# EAGLE design PIC18_breakout (EAGLE 7.7.0)
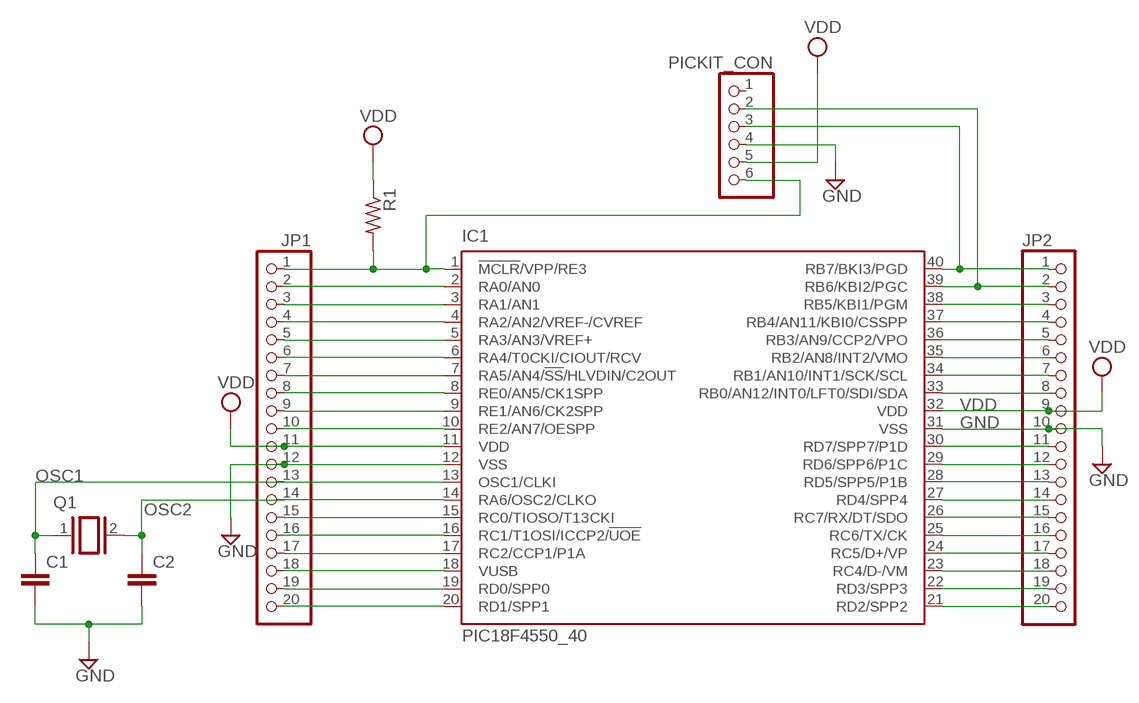
[diagram p0: schematic, sheet 1]

## Parts
C1  C-EU075-032X103  [C075-032X103]
C2  C-EU075-032X103  [C075-032X103]
IC1  PIC18F4550_40  [DIL40]
JP1  PINHD-1X20  [1X20]
JP2  PINHD-1X20  [1X20]
PICKIT_CON  PINHD-1X6/90  [1X06/90]
Q1  XTAL/S  [QS]
R1  R-US_0207/10  [0207/10]

## Nets
^MCLR/VPP: IC1.1(!MCLR!/VPP/RE3) JP1.1 PICKIT_CON.6 R1.2
GND: C1.2 C2.2 IC1.12(VSS) IC1.31(VSS) JP1.12 JP2.10 PICKIT_CON.4
N$1: IC1.2(RA0/AN0) JP1.2
N$2: IC1.3(RA1/AN1) JP1.3
N$3: IC1.4(RA2/AN2/VREF-/CVREF) JP1.4
N$4: IC1.5(RA3/AN3/VREF+) JP1.5
N$5: IC1.6(RA4/T0CKI/CIOUT/RCV) JP1.6
N$6: IC1.7(RA5/AN4/!SS!/HLVDIN/C2OUT) JP1.7
N$7: IC1.8(RE0/AN5/CK1SPP) JP1.8
N$8: IC1.9(RE1/AN6/CK2SPP) JP1.9
N$9: IC1.10(RE2/AN7/OESPP) JP1.10
N$10: IC1.37(RB4/AN11/KBI0/CSSPP) JP2.4
N$11: IC1.36(RB3/AN9/CCP2/VPO) JP2.5
N$12: IC1.15(RC0/TIOSO/T13CKI) JP1.15
N$13: IC1.16(RC1/T1OSI/ICCP2/!UOE) JP1.16
N$14: IC1.17(RC2/CCP1/P1A) JP1.17
N$15: IC1.18(VUSB) JP1.18
N$16: IC1.19(RD0/SPP0) JP1.19
N$17: IC1.20(RD1/SPP1) JP1.20
N$18: IC1.35(RB2/AN8/INT2/VMO) JP2.6
N$19: IC1.34(RB1/AN10/INT1/SCK/SCL) JP2.7
N$20: IC1.33(RB0/AN12/INT0/LFT0/SDI/SDA) JP2.8
N$21: IC1.30(RD7/SPP7/P1D) JP2.11
N$22: IC1.29(RD6/SPP6/P1C) JP2.12
N$23: IC1.28(RD5/SPP5/P1B) JP2.13
N$24: IC1.27(RD4/SPP4) JP2.14
N$25: IC1.26(RC7/RX/DT/SDO) JP2.15
N$26: IC1.25(RC6/TX/CK) JP2.16
N$27: IC1.24(RC5/D+/VP) JP2.17
N$28: IC1.23(RC4/D-/VM) JP2.18
N$29: IC1.22(RD3/SPP3) JP2.19
N$30: IC1.21(RD2/SPP2) JP2.20
OSC1: C1.1 IC1.13(OSC1/CLKI) JP1.13 Q1.1
OSC2: C2.1 IC1.14(RA6/OSC2/CLKO) JP1.14 Q1.2
PGC: IC1.39(RB6/KBI2/PGC) JP2.2 PICKIT_CON.2
PGD: IC1.40(RB7/BKI3/PGD) JP2.1 PICKIT_CON.3
PGM: IC1.38(RB5/KBI1/PGM) JP2.3
VDD: IC1.11(VDD) IC1.32(VDD) JP1.11 JP2.9 PICKIT_CON.5 R1.1
Unconnected: PICKIT_CON.1

## Library data of the parts
C1 C2 = rcl:C-EU: CAPACITOR, European symbol
IC1 = microchip:PIC18F4*_40: USB Microcontrollers with nanoWatt Technology High-Performance, Enhanced Flash, 28/40/44-Pin, Source: http://ww1.microchip.com/downloads/en/devicedoc/39632c.pdf; MF: MICROCHIP; MPN: PIC18F4550-I/P; OC_FARNELL: 9321357; OC_NEWARK: 74K8623
JP1 JP2 = pinhead:PINHD-1X20: PIN HEADER
PICKIT_CON = pinhead:PINHD-1X6: PIN HEADER
Q1 = special:XTAL/S: CRYSTAL
R1 = rcl:R-US_: RESISTOR, American symbol

## Board
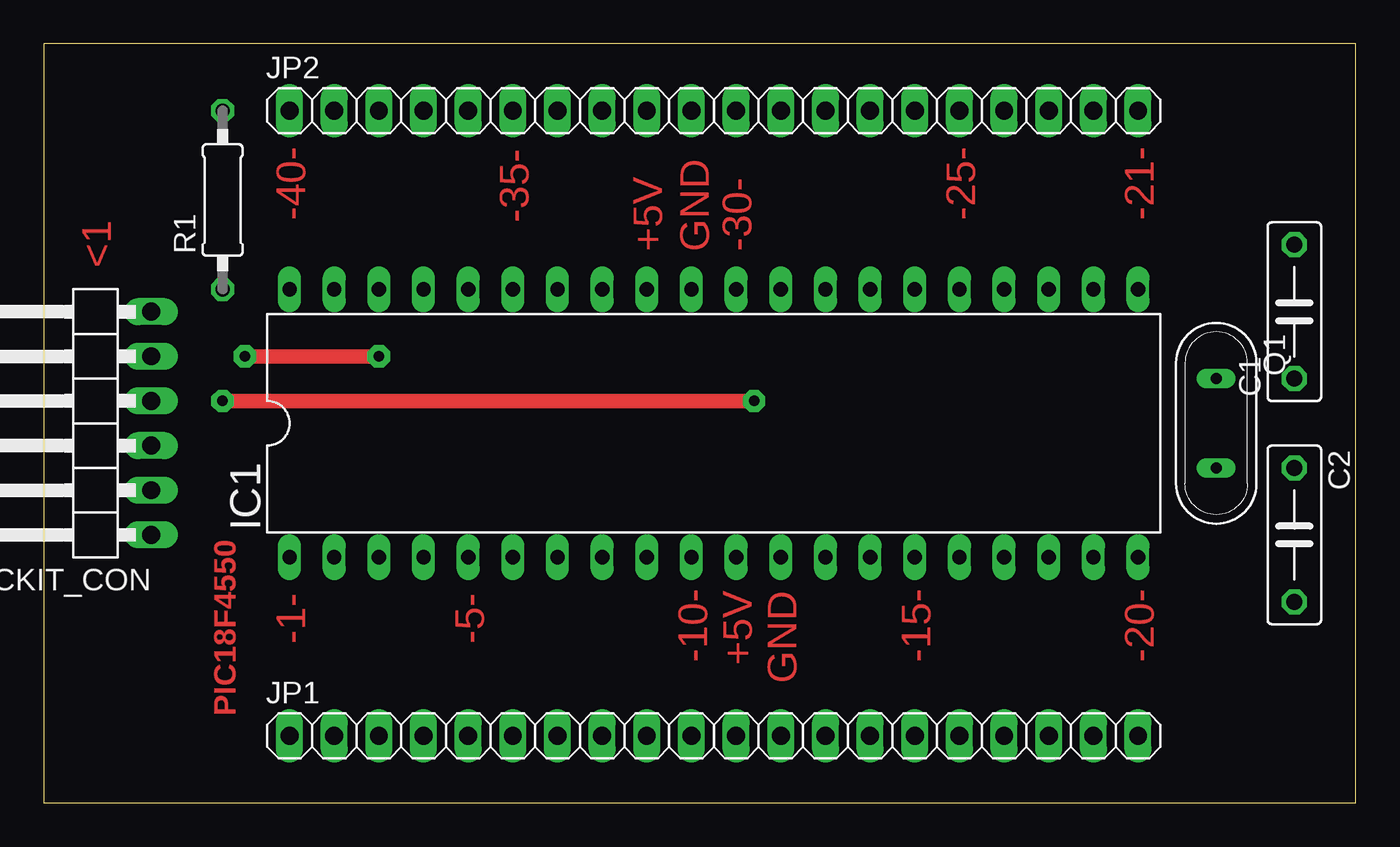
[diagram p1: board, top side]
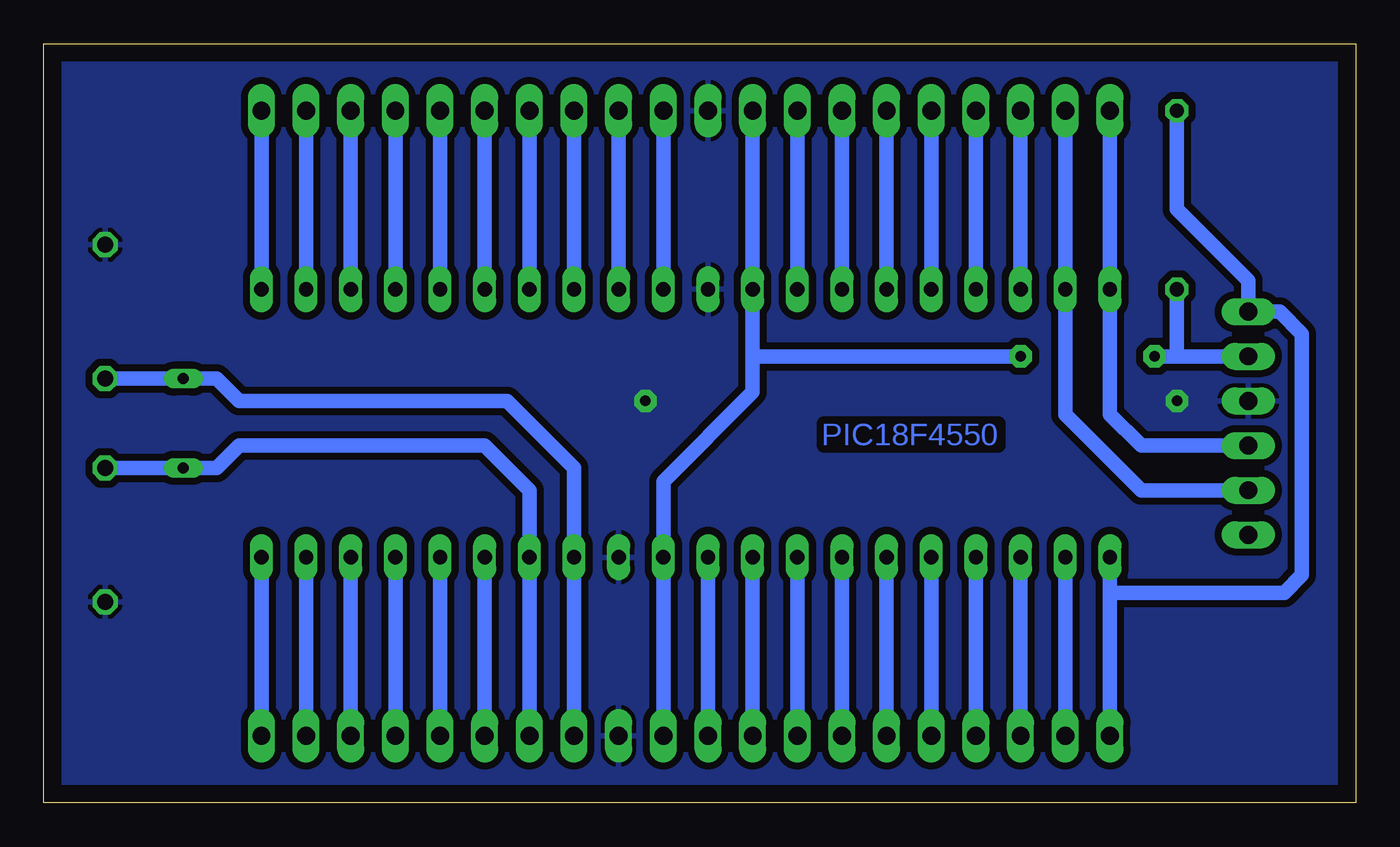
[diagram p2: board, bottom side, seen from below]

Size 74.6 x 43.17 mm. Coordinates in mm from the lower left corner, seen from the top.
Outline: 0,0 74.6,0 74.6,43.17 0,43.17 0,0
Copper layers (1*16): Top 0.035mm / dielectric 1.5mm / Bottom 0.035mm
Design rules "default *": minimum track width 10mil, minimum drill 24mil, track to track 8mil, track to pad 8mil, pad to pad 8mil, via to via 8mil, smd to smd 8mil, copper to edge 40mil, drill to drill 8mil, minimum pad ring 10mil, minimum via ring 8mil, stop-mask expansion 4mil, vias tented up to drill 0mil, thermal gap 10mil

### Footprints (pad centres in the part's own frame; a part is rotated, then mirrored left to right if it is on the bottom)
C075-032X103 = drill 0.914 octagon: 1 -3.81,0; 2 3.81,0
DIL40 = drill 0.813 long: 1 -24.13,-7.62; 2 -21.59,-7.62; 3 -19.05,-7.62; 4 -16.51,-7.62; 5 -13.97,-7.62; 6 -11.43,-7.62; 7 -8.89,-7.62; 8 -6.35,-7.62; 9 -3.81,-7.62; 10 -1.27,-7.62; 11 1.27,-7.62; 12 3.81,-7.62; 13 6.35,-7.62; 14 8.89,-7.62; 15 11.43,-7.62; 16 13.97,-7.62; 17 16.51,-7.62; 18 19.05,-7.62; 19 21.59,-7.62; 20 24.13,-7.62; 21 24.13,7.62; 22 21.59,7.62; 23 19.05,7.62; 24 16.51,7.62; 25 13.97,7.62; 26 11.43,7.62; 27 8.89,7.62; 28 6.35,7.62; 29 3.81,7.62; 30 1.27,7.62; 31 -1.27,7.62; 32 -3.81,7.62; 33 -6.35,7.62; 34 -8.89,7.62; 35 -11.43,7.62; 36 -13.97,7.62; 37 -16.51,7.62; 38 -19.05,7.62; 39 -21.59,7.62; 40 -24.13,7.62
1X20 = drill 1.016 long: 1 -24.13,0; 2 -21.59,0; 3 -19.05,0; 4 -16.51,0; 5 -13.97,0; 6 -11.43,0; 7 -8.89,0; 8 -6.35,0; 9 -3.81,0; 10 -1.27,0; 11 1.27,0; 12 3.81,0; 13 6.35,0; 14 8.89,0; 15 11.43,0; 16 13.97,0; 17 16.51,0; 18 19.05,0; 19 21.59,0; 20 24.13,0
1X06/90 = drill 1.016 long: 1 -6.35,-3.81; 2 -3.81,-3.81; 3 -1.27,-3.81; 4 1.27,-3.81; 5 3.81,-3.81; 6 6.35,-3.81
QS = drill 0.61 long: 1 -2.54,0; 2 2.54,0
0207/10 = drill 0.813 octagon: 1 -5.08,0; 2 5.08,0

### Placement (x,y rotation side)
C1  71.12,27.94 90 top
C2  71.12,15.24 270 top
IC1  38.1,21.59 0 top
JP1  38.1,3.81 0 top
JP2  38.1,39.37 0 top
PICKIT_CON  2.29,21.59 90 top
Q1  66.67,21.59 270 top
R1  10.16,34.29 90 top

### Tracks (layer width: path | path; a pad name or v marks a point on that pad's centre or on a via)
^MCLR/VPP
  Bottom 0.813: IC1.1 13.97,11.68 | 13.97,11.68 JP1.1 | 13.97,11.68 13.72,11.94 4.06,11.94 3.05,12.95 3.05,26.67 4.32,27.94 PICKIT_CON.6 6.1,29.72 10.16,33.78 R1.2
GND  (via drill 0.6 pad 1.27)
  Top 0.813: v10.16,22.86 v40.39,22.86
  pour Bottom (isolate 0.406): 0,-1.27 0,44.45 77.47,44.45 77.47,-1.27
N$1
  Bottom 0.813: JP1.2 IC1.2
N$2
  Bottom 0.813: IC1.3 JP1.3
N$3
  Bottom 0.813: JP1.4 IC1.4
N$4
  Bottom 0.813: JP1.5 IC1.5
N$5
  Bottom 0.813: IC1.6 JP1.6
N$6
  Bottom 0.813: JP1.7 IC1.7
N$7
  Bottom 0.813: JP1.8 IC1.8
N$8
  Bottom 0.813: IC1.9 JP1.9
N$9
  Bottom 0.813: JP1.10 IC1.10
N$10
  Bottom 0.813: JP2.4 IC1.37
N$11
  Bottom 0.813: IC1.36 JP2.5
N$12
  Bottom 0.813: JP1.15 IC1.15
N$13
  Bottom 0.813: IC1.16 JP1.16
N$14
  Bottom 0.813: JP1.17 IC1.17
N$15
  Bottom 0.813: IC1.18 JP1.18
N$16
  Bottom 0.813: JP1.19 IC1.19
N$17
  Bottom 0.813: IC1.20 JP1.20
N$18
  Bottom 0.813: JP2.6 IC1.35
N$19
  Bottom 0.813: IC1.34 JP2.7
N$20
  Bottom 0.813: JP2.8 IC1.33
N$21
  Bottom 0.813: IC1.30 JP2.11
N$22
  Bottom 0.813: JP2.12 IC1.29
N$23
  Bottom 0.813: IC1.28 JP2.13
N$24
  Bottom 0.813: JP2.14 IC1.27
N$25
  Bottom 0.813: IC1.26 JP2.15
N$26
  Bottom 0.813: JP2.16 IC1.25
N$27
  Bottom 0.813: IC1.24 JP2.17
N$28
  Bottom 0.813: JP2.18 IC1.23
N$29
  Bottom 0.813: IC1.22 JP2.19
N$30
  Bottom 0.813: JP2.20 IC1.21
OSC1
  Bottom 0.813: JP1.13 IC1.13 44.45,19.05 48.26,22.86 63.5,22.86 64.77,24.13 Q1.1 C1.1
OSC2
  Bottom 0.813: JP1.14 IC1.14 46.99,17.78 49.53,20.32 63.5,20.32 64.77,19.05 Q1.2 C2.1
PGC
  Bottom 0.813: JP2.2 IC1.39 16.51,22.1 12.19,17.78 PICKIT_CON.2
PGD
  Bottom 0.813: JP2.1 IC1.40 13.97,22.1 12.19,20.32 PICKIT_CON.3
PGM
  Bottom 0.813: JP2.3 IC1.38
VDD  (via drill 0.6 pad 1.27)
  Top 0.813: v11.43,25.4 v19.05,25.4
  Bottom 0.813: JP1.11 IC1.11 39.37,18.29 34.29,23.37 34.29,25.4 | JP2.9 IC1.32 34.29,25.4 | PICKIT_CON.5 10.16,25.4 | 10.16,25.4 v11.43,25.4 | v19.05,25.4 34.29,25.4 | R1.1 10.16,25.4

### Text on the board
Top: -40- | -35- | -25- | -21- | <1 | +5V | GND | -30- | PIC18F4550 | -1- | -5- | -10- | +5V | GND | -15- | -20-
Bottom: PIC18F4550